# Altium schematic sheet PDM-S01-V00-BatteryProtection.SchDoc: Battery Input Protection
size A3; DrawnBy: Zoe Goodward; Organization: QUT Motorsport; Address1: O-120, Gardens Point; Address2: 2 George Street; Address3: Brisbane, QLD 4000; Address4: Australia; DocumentNumber: ####; Revision: 01; SheetNumber: 1; SheetTotal: 1; Version: 01; Project: Power Distribution Module 2020; PageSetup: Record=PageOptions|CenterHorizontal=True|CenterVertical=True|PrintScale=0.97|XCorrection=1.00|YCorrection=1.00|PrintKind=0|BorderSize=5000000|LeftOffset=0|BottomOffset=0|Orientation=2|PaperLength=1000|PaperWidth=1000|Scale=100|PaperSource=7|PrintQuality=-4|MediaType=1|DitherType=10|PaperKind=A4|PrintScaleMode=1
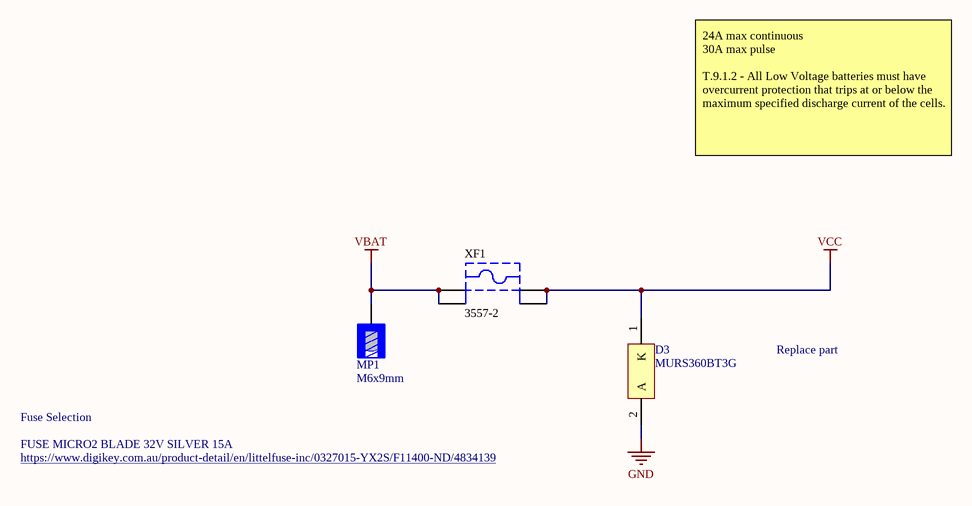
[diagram p0: PDM-S01-V00-BatteryProtection.SchDoc]

## Parts
D3  MURS360BT3G  [ONSC-SMB-2-403A-03_V]
MP1  M6x9mm  [7461084_for chemical surfaces]
XF1  3557-2  [KSTN-3557-2]

## Nets
GND: D3.2(A)
VBAT: MP1.1 XF1.1 XF1.2
VCC: D3.1(K) XF1.3 XF1.4

## Notes on the sheet
- 24A max continuous
  30A max pulse
  T.9.1.2 - All Low Voltage batteries must have overcurrent protection that trips at or below the maximum specified discharge current of the cells.
- Replace part
- FUSE MICRO2 BLADE 32V SILVER 15A
- Fuse Selection
- https://www.digikey.com.au/product-detail/en/littelfuse-inc/0327015-YX2S/F11400-ND/4834139
- Revision History:
- Sheet Title:
- Rev
- Date
- Description
- Project:
- Size:
- Drawn By:
- A3
- Number:
- Revision:
- Sheet
- Version:
- of
- QUT Motorsport
- O-120, Gardens Point
- 2 George Street
- Brisbane, QLD 4000
- Australia
- Print Date:
- Print Time:
- File Name:

## Library data of the parts
D3 = CMP-0902-00327-1: Surface Mount Ultrafast Power Rectifier, 2-Pin SMB, Pb-Free, Tape and Reel; Manufacturer: On Semiconductor; VRRM Max (V): 600; IFSM Max (A): 100; PackageVersion: Rev. J, 07/2012; ComponentLink3Description: Package Specification; ComponentLink2URL: http://www.onsemi.cn/pub_link/Collateral/MURS360BT3-D.PDF; PackageDescription: 2-Pin Small Molded Package, J-Bend Lead, Body 4.33 x 3.625 mm; Type: Ultrafast; RoHS: TRUE; Mounting Technology: Surface Mount; Packing: Tape and Reel; ComponentLink2Description: Datasheet; ComponentLink1URL: http://www.onsemi.com/; DatasheetVersion: Rev. 5; PartNumber: MURS360BT3G; ComponentLink3URL: http://www.onsemi.com/pub_link/Collateral/403A-03.PDF; PackageReference: SMB-2-403A-03; ComponentLink1Description: Manufacturer URL
MP1 = 7461084: WP-BUTR Press-Fit with Internal thread, two rows, 10x10mm, 8 pins, M6x9mm, 160A; Pin Number: 8; Thread Length: 9mm; Thread: M6; Surface: Tin; ComponentLink1Description: Manufacturer; ComponentLink1URL: http://www.we-online.de; ComponentLink2Description: Datasheet; ComponentLink2URL: https://katalog.we-online.com/em/datasheet/7461084.pdf; Operating Temperature: -55 to +150degC; Height: 13.5mm; Material: Brass; Part Number: 7461084; Packaging: Bulk; Mounting Technology: Press-Fit; Rated Current: 160A; Publisher: Wurth Elektronik; Published Date: September 2019; Size: 10x10mm
XF1 = CMP-2000-05461-1: FUSE HOLDER, PCB MOUNT, 500VAC, 20A, ROHS; Manufacturer: Keystone-Electronics; Number of Circuits: 1; Voltage: 500V; Fuseholder Type: Block; Fuse Type: Blade; Fuse Size: 0.43"Lx0.15"Wx0.64"H(10.92mmx3.81mmx16.25mm); For Use With/Related Products: ATC,ATO257,MINI897; Current Rating: 30A; Datasheet URL: http://datasheet.octopart.com/3557-2-Keystone-datasheet-15715937.pdf; Orientation: Vertical; Family: Fuseholders; Datasheet Version: Apr-13; Contact Finish: TinNickel; Mounting Type: PCB; Series: -; Category: CircuitProtection; Termination Style: PCPin; Contact Material: Brass; Manufacturer URL: http://www.keyelco.com/